# Altium schematic sheet x_mas_esquemático.SchDoc
size A4; SheetNumber: 1; SheetTotal: 1
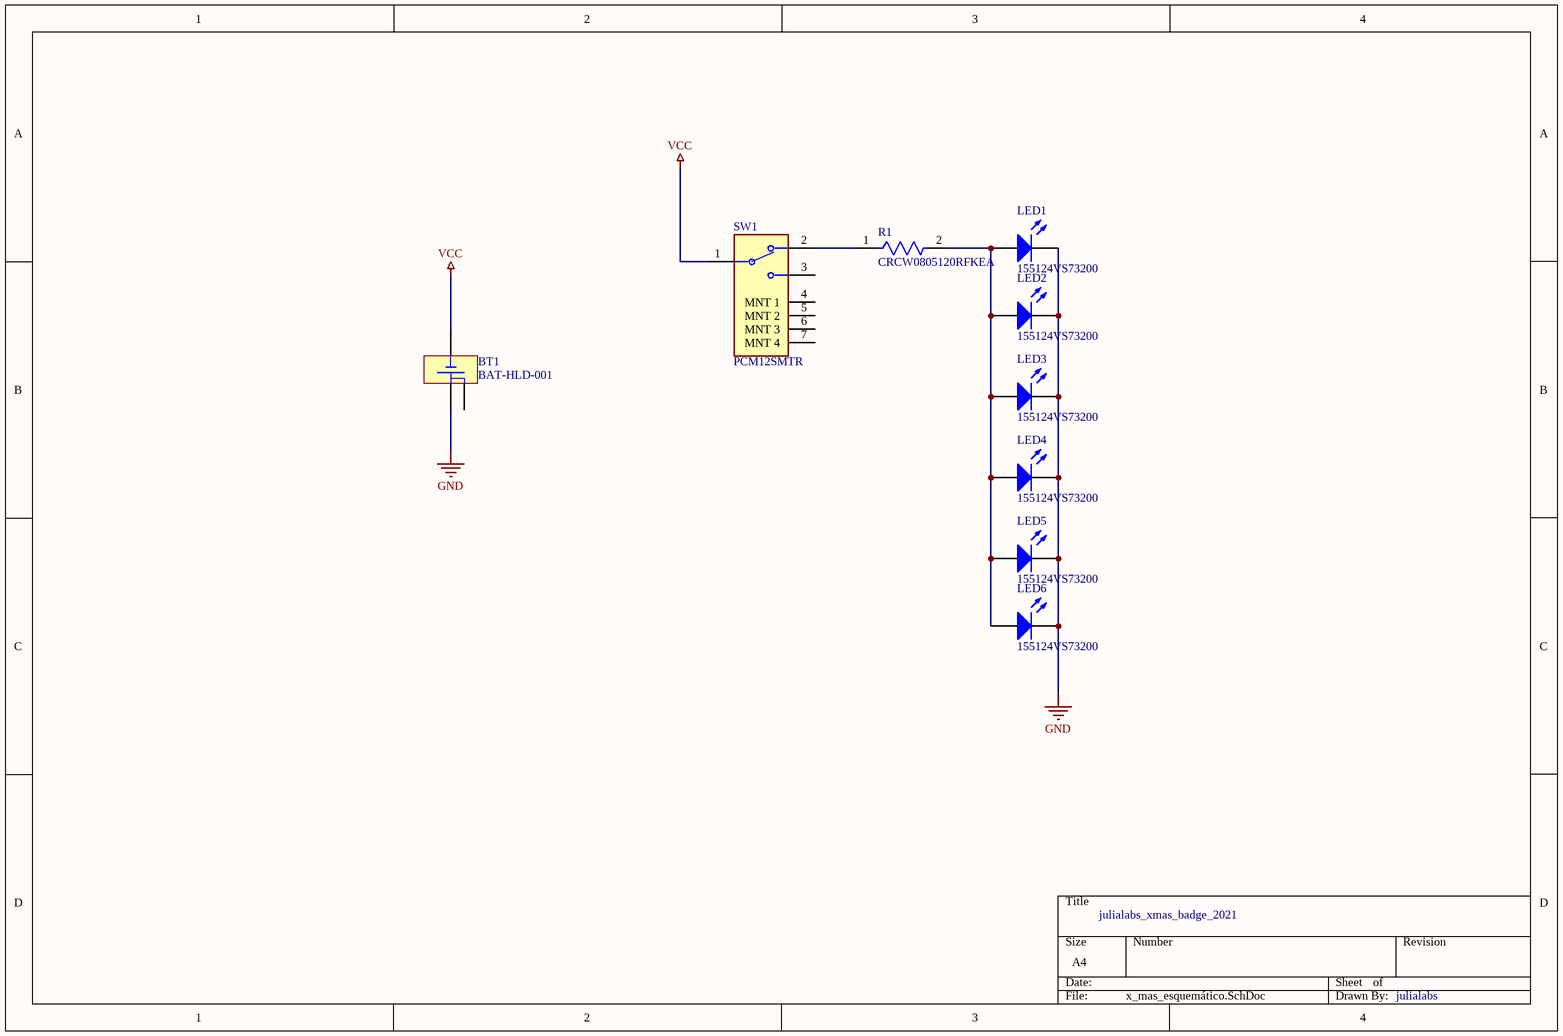
[diagram p0: x_mas_esquemático.SchDoc]

## Parts
BT1  BAT-HLD-001  [BATHLD-001]
LED1  155124VS73200  [1204]
LED2  155124VS73200  [1204]
LED3  155124VS73200  [1204]
LED4  155124VS73200  [1204]
LED5  155124VS73200  [1204]
LED6  155124VS73200  [1204]
R1  CRCW0805120RFKEA  [FP-CRCW0805-e3-IPC_C]
SW1  PCM12SMTR  [FP-PCM12SMTR-MFG]

## Nets
GND: BT1.2(+) LED1.1(K) LED2.1(K) LED3.1(K) LED4.1(K) LED5.1(K) LED6.1(K)
VCC: BT1.1(-) SW1.1
NetLED1_2: LED1.2(A) LED2.2(A) LED3.2(A) LED4.2(A) LED5.2(A) LED6.2(A) R1.2
NetR1_1: R1.1 SW1.2

Not connected (* = marked no-connect by the designer): BT1 3(+); SW1 3 4(MNT_1) 5(MNT_2) 6(MNT_3) 7(MNT_4)

## Notes on the sheet
- julialabs_xmas_badge_2021
- julialabs

## Library data of the parts
BT1 = CMP-0168-00043-1: 20mm Coin Cell Battery Holder; PCB_Layout: Complies with manufacturer's recommendation.; DatasheetVersion: rev1.0, Dec-2007; PackageVersion: rev1.0, Dec-2007; PackageReference: BATHLD-001; PackageDescription: Low Profile SM Battery Holder, 20mm Lithium Cell, 21.1 x 15.3 x 4.2 mm Body
LED1-LED6 = CMP-1427-00004-1: SMD Side view mono-color Chip LED-Round , WL-SMSW, Bright Green; Manufacturer: Wuerth Elektronik; Color: Bright Green; PartNumber: 155124VS73200; ComponentLink2Description: Datasheet; ComponentLink2URL: http://katalog.we-online.com/led/datasheet/155124VS73200.pdf; ComponentLink1Description: Manufacturer URL; ComponentLink1URL: http://www.we-online.com; PackageReference: 1204
R1 = CMP-02407-007854-1: RES Thick Film, 120Ω, 1%, 0.125W, 100ppm/°C, 0805; Resistance: 120R; Voltage Rating (DC): 150V; Max Power Dissipation: 125mW; Height: 0.45mm; Min Operating Temperature: -55°C; Packaging: Tape and Reel; Package Quantity: 10; Width: 1.25mm; Weight: 0.000194oz; Termination: SMD/SMT; Mount: Surface Mount; Tolerance: 1%; Military Standard: Not; Max Operating Temperature: 155°C; Lead Free: Lead Free; Number of Terminations: 2; Radiation Hardening: No; Temperature Coefficient: 100ppm/°C; Length: 2mm; Case/Package: 0805; Voltage Rating: 150V; Case Code (Metric): 2012; Case Code (Imperial): 0805; Features: Automotive AEC-Q200; Composition: Thick Film; Contact Plating: Tin; Power Rating: 125mW; Depth: 1.25mm
SW1 = CMP-2000-06884-2: SWITCH SLIDE SPDT 300MA 6V; Actuator Material: Nylon; Switch Function: On-On; Insulation Resistance: 100mR; Actuator Type: Standard; Mechanical Life: 10000Cycles; Actuator Length: 1.5mm; Contact Resistance: 70mR; Min Operating Temperature: -20°C; Max Current Rating: 300mA; Max Voltage Rating (DC): 6V; Package Quantity: 1; Mount: Surface Mount; Packaging: Tape and Reel; Contact Plating: Silver; Depth: 5mm; REACH SVHC: No SVHC; Voltage Rating (DC): 6V; Voltage Rating (AC): 6V; Max Operating Temperature: 85°C; Length: 7.7mm; Termination: Gull Wing; Current Rating: 300mA; Contact Current Rating: 300mA; Orientation: Right Angle; Width: 6.7mm; Switch Travel: 1.5mm; Lead Free: Lead Free; Contact Material: Copper Alloy; Throw Configuration: SPDT